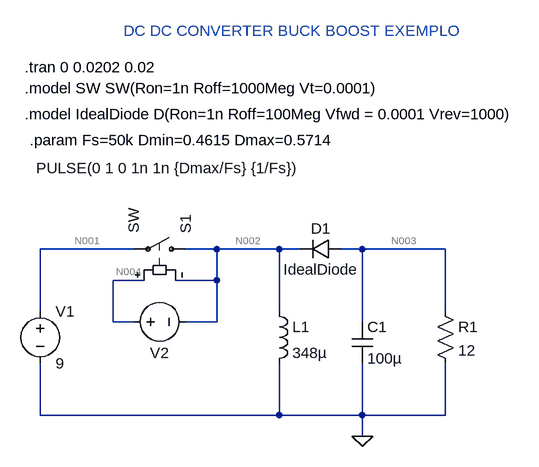
[diagram p0: schematic DC_DC_Converter.asc]
DC_DC_Converter.asc, the LTspice schematic file:
Version 4.1
SHEET 1 880 680
WIRE 48 80 -96 80
WIRE 176 80 128 80
WIRE 272 80 176 80
WIRE 304 80 272 80
WIRE 400 80 368 80
WIRE 528 80 400 80
WIRE 64 128 16 128
WIRE 176 128 176 80
WIRE 176 128 112 128
WIRE -96 176 -96 80
WIRE 272 176 272 80
WIRE 528 176 528 80
WIRE 16 192 16 128
WIRE 48 192 16 192
WIRE 176 192 176 128
WIRE 176 192 128 192
WIRE 400 192 400 80
WIRE -96 336 -96 256
WIRE 272 336 272 256
WIRE 272 336 -96 336
WIRE 400 336 400 256
WIRE 400 336 272 336
WIRE 528 336 528 256
WIRE 528 336 400 336
WIRE 400 368 400 336
FLAG 400 368 0
SYMBOL voltage -96 160 R0
WINDOW 123 0 0 Left 0
WINDOW 39 0 0 Left 0
SYMATTR InstName V1
SYMATTR Value 9
SYMBOL voltage 32 192 R270
WINDOW 0 -32 56 VBottom 2
WINDOW 3 221 69 VTop 2
WINDOW 123 0 0 Left 0
WINDOW 39 0 0 Left 0
SYMATTR InstName V2
SYMATTR Value PULSE(0 1 0 1n 1n {Dmax/Fs} {1/Fs})
SYMBOL sw 144 80 M270
SYMATTR InstName S1
SYMBOL ind 256 160 R0
SYMATTR InstName L1
SYMATTR Value 348µ
SYMBOL cap 384 192 R0
SYMATTR InstName C1
SYMATTR Value 100µ
SYMBOL res 512 160 R0
SYMATTR InstName R1
SYMATTR Value 12
SYMBOL diode 368 64 R90
WINDOW 0 0 32 VBottom 2
WINDOW 3 32 32 VTop 2
SYMATTR InstName D1
SYMATTR Value IdealDiode
TEXT -120 -200 Left 2 !.tran 0 0.0202 0.02
TEXT -120 -168 Left 2 !.model SW SW(Ron=1n Roff=1000Meg Vt=0.0001)
TEXT -120 -128 Left 2 !.model IdealDiode D(Ron=1n Roff=100Meg Vfwd = 0.0001 Vrev=1000)
TEXT -112 -88 Left 2 !.param Fs=50k Dmin=0.4615 Dmax=0.5714
TEXT 32 -256 Left 2 ;DC DC CONVERTER BUCK BOOST EXEMPLO

The netlist it stands for:
* DC_DC_Converter.asc
V1 N001 0 9
V2 N004 N002 PULSE(0 1 0 1n 1n {Dmax/Fs} {1/Fs})
S1 N002 N001 N004 N002 SW
L1 N002 0 348µ
C1 N003 0 100µ
R1 N003 0 12
D1 N003 N002 IdealDiode
.model D D
.lib standard.dio
.tran 0 0.0202 0.02
.model SW SW(Ron=1n Roff=1000Meg Vt=0.0001)
.model IdealDiode D(Ron=1n Roff=100Meg Vfwd = 0.0001 Vrev=1000)
.param Fs=50k Dmin=0.4615 Dmax=0.5714
* DC DC CONVERTER BUCK BOOST EXEMPLO
.backanno
.end

* Results of the author's LTspice run, read from the files saved beside the schematic
* Operating Point, zero values left out:
*   V(n001) = 9 V
*   I(V1) = -9.009 nA
*   I(S1) = 9.009 nA
*   I(L1) = 9.009 nA
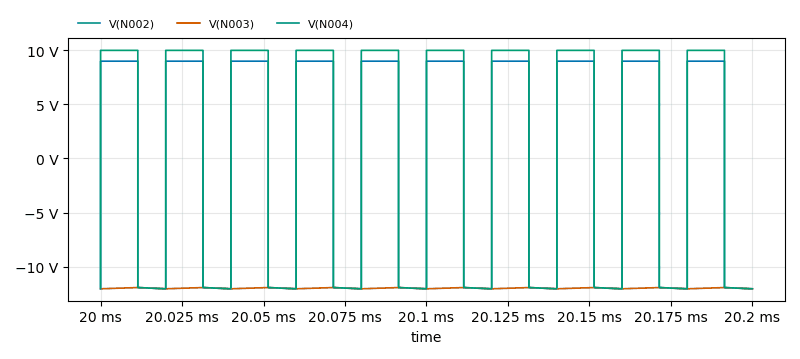
[diagram p1: Transient Analysis of DC_DC_Converter.asc, plotted from the saved traces]
* Transient Analysis, 1 run:
*   V(N002): min -12.05 V, max 9 V, average 3.466 mV, rms 10.39 V, last -12.05 V
*   V(N003): min -12.05 V, max -11.94 V, average -11.99 V, rms 11.99 V, last -12.05 V
*   V(N004): min -12.05 V, max 10 V, average 574.9 mV, rms 10.9 V, last -12.05 V